# Altium schematic sheet PowerBoard.SchDoc
size A4
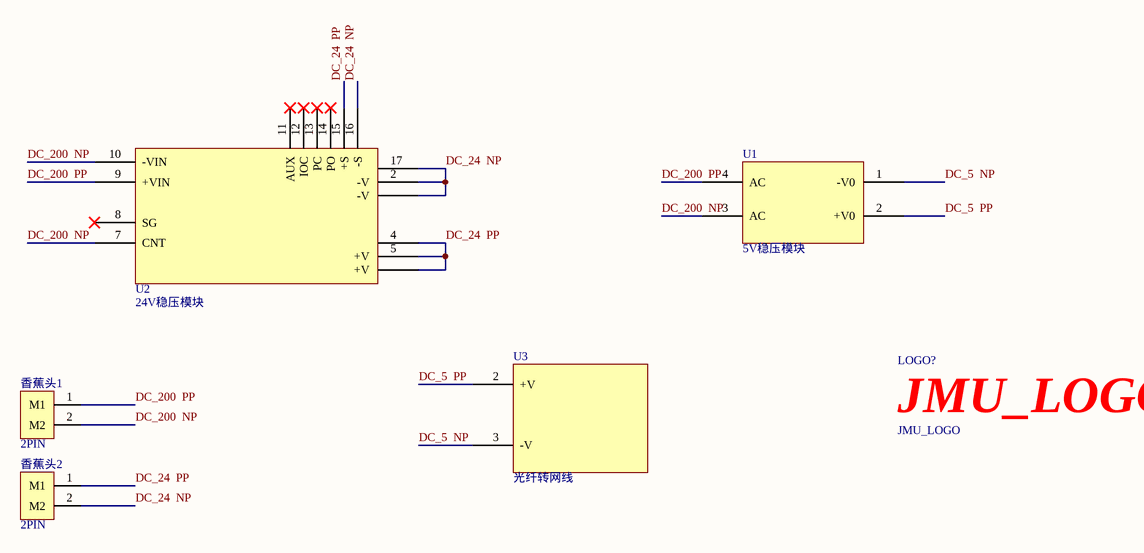
[diagram p0: PowerBoard.SchDoc]

## Parts
LOGO?  JMU_LOGO  [JMU_LOGO(1.35cm)]
U1  5V稳压模块  [DC—DC（200-5）]
U2  24V稳压模块  [DC-DC（400——24）]
U3  光纤转网线  [光纤转网线]
香蕉头1  2PIN  [XT60-F]
香蕉头2  2PIN  [XT60-F]

## Nets
DC_5  NP: U1.1(-V0) U3.3(-V)
DC_5  PP: U1.2(+V0) U3.2(+V)
DC_24  NP: U2.2(-V) U2.3(-V) U2.16(-S) U2.17 香蕉头2.2(M2)
DC_24  PP: U2.4 U2.5(+V) U2.6(+V) U2.15(+S) 香蕉头2.1(M1)
DC_200  NP: U1.3(AC) U2.7(CNT) U2.10(-VIN) 香蕉头1.2(M2)
DC_200  PP: U1.4(AC) U2.9(+VIN) 香蕉头1.1(M1)

Not connected (* = marked no-connect by the designer): U2 8(SG)* 11(AUX)* 12(IOC)* 13(PC)* 14(PO)*

## Library data of the parts
LOGO? = JMU_LOGO: LOGO
U1 = DC-DC（200—5）V
U2 = DC-DC（400——24）
香蕉头1 香蕉头2 = 接线端子-2PIN